# Altium schematic sheet B2_RAD_FPGA.SchDoc: ASIM MXGS PSU Controller QM
size A2; Author: Andrzej Cichocki; Organization: Space Research Centre; Address1: Bartycka 18a; Address2: 00-716 Warsaw; Address3: Poland; Revision: 1; ModuleName: MainBoard Main; SubOrganization1: FPGA Satellite Applications Lab.
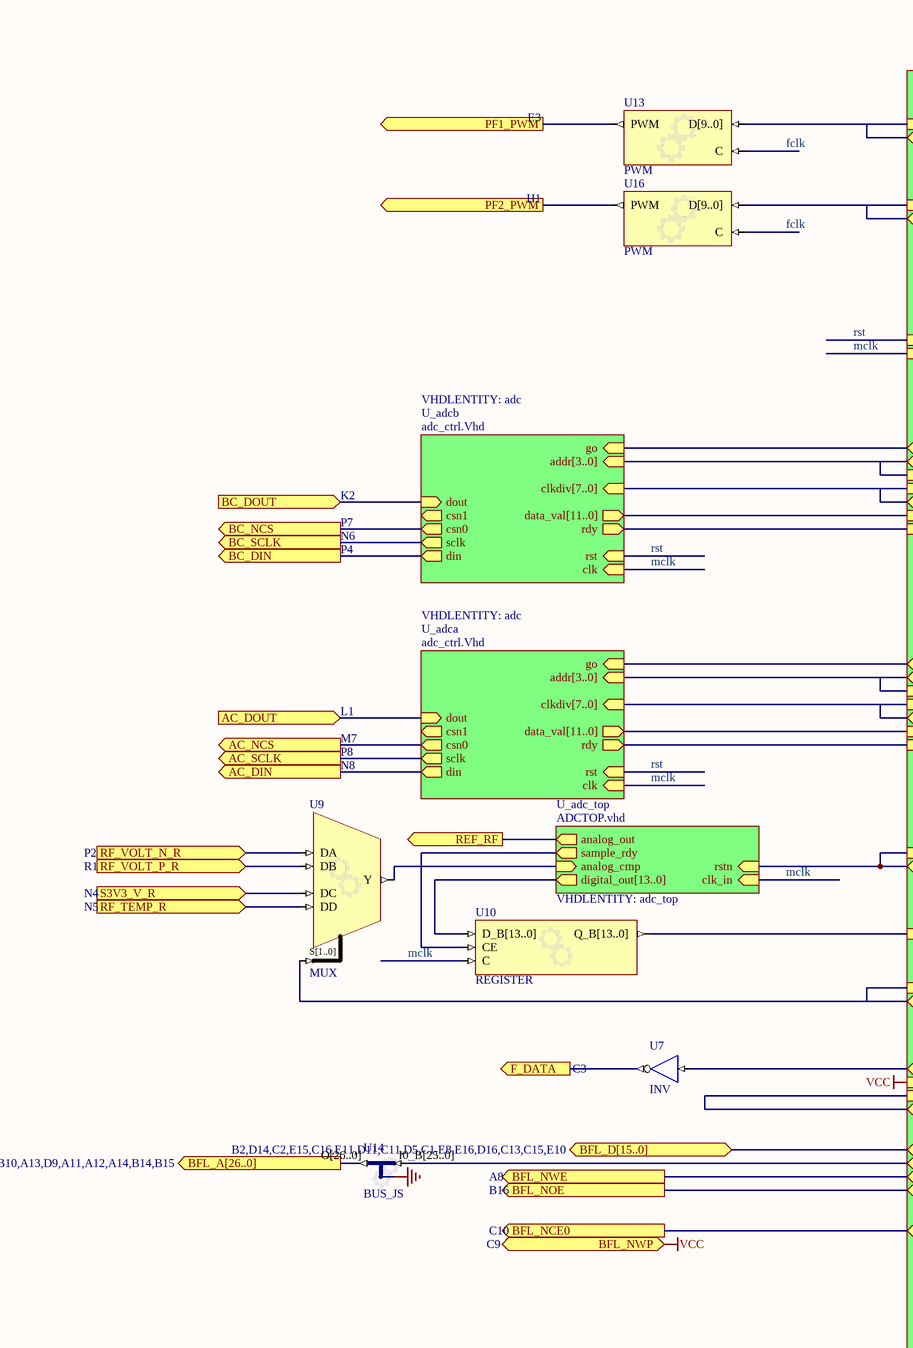
[diagram p0: B2_RAD_FPGA.SchDoc, left]
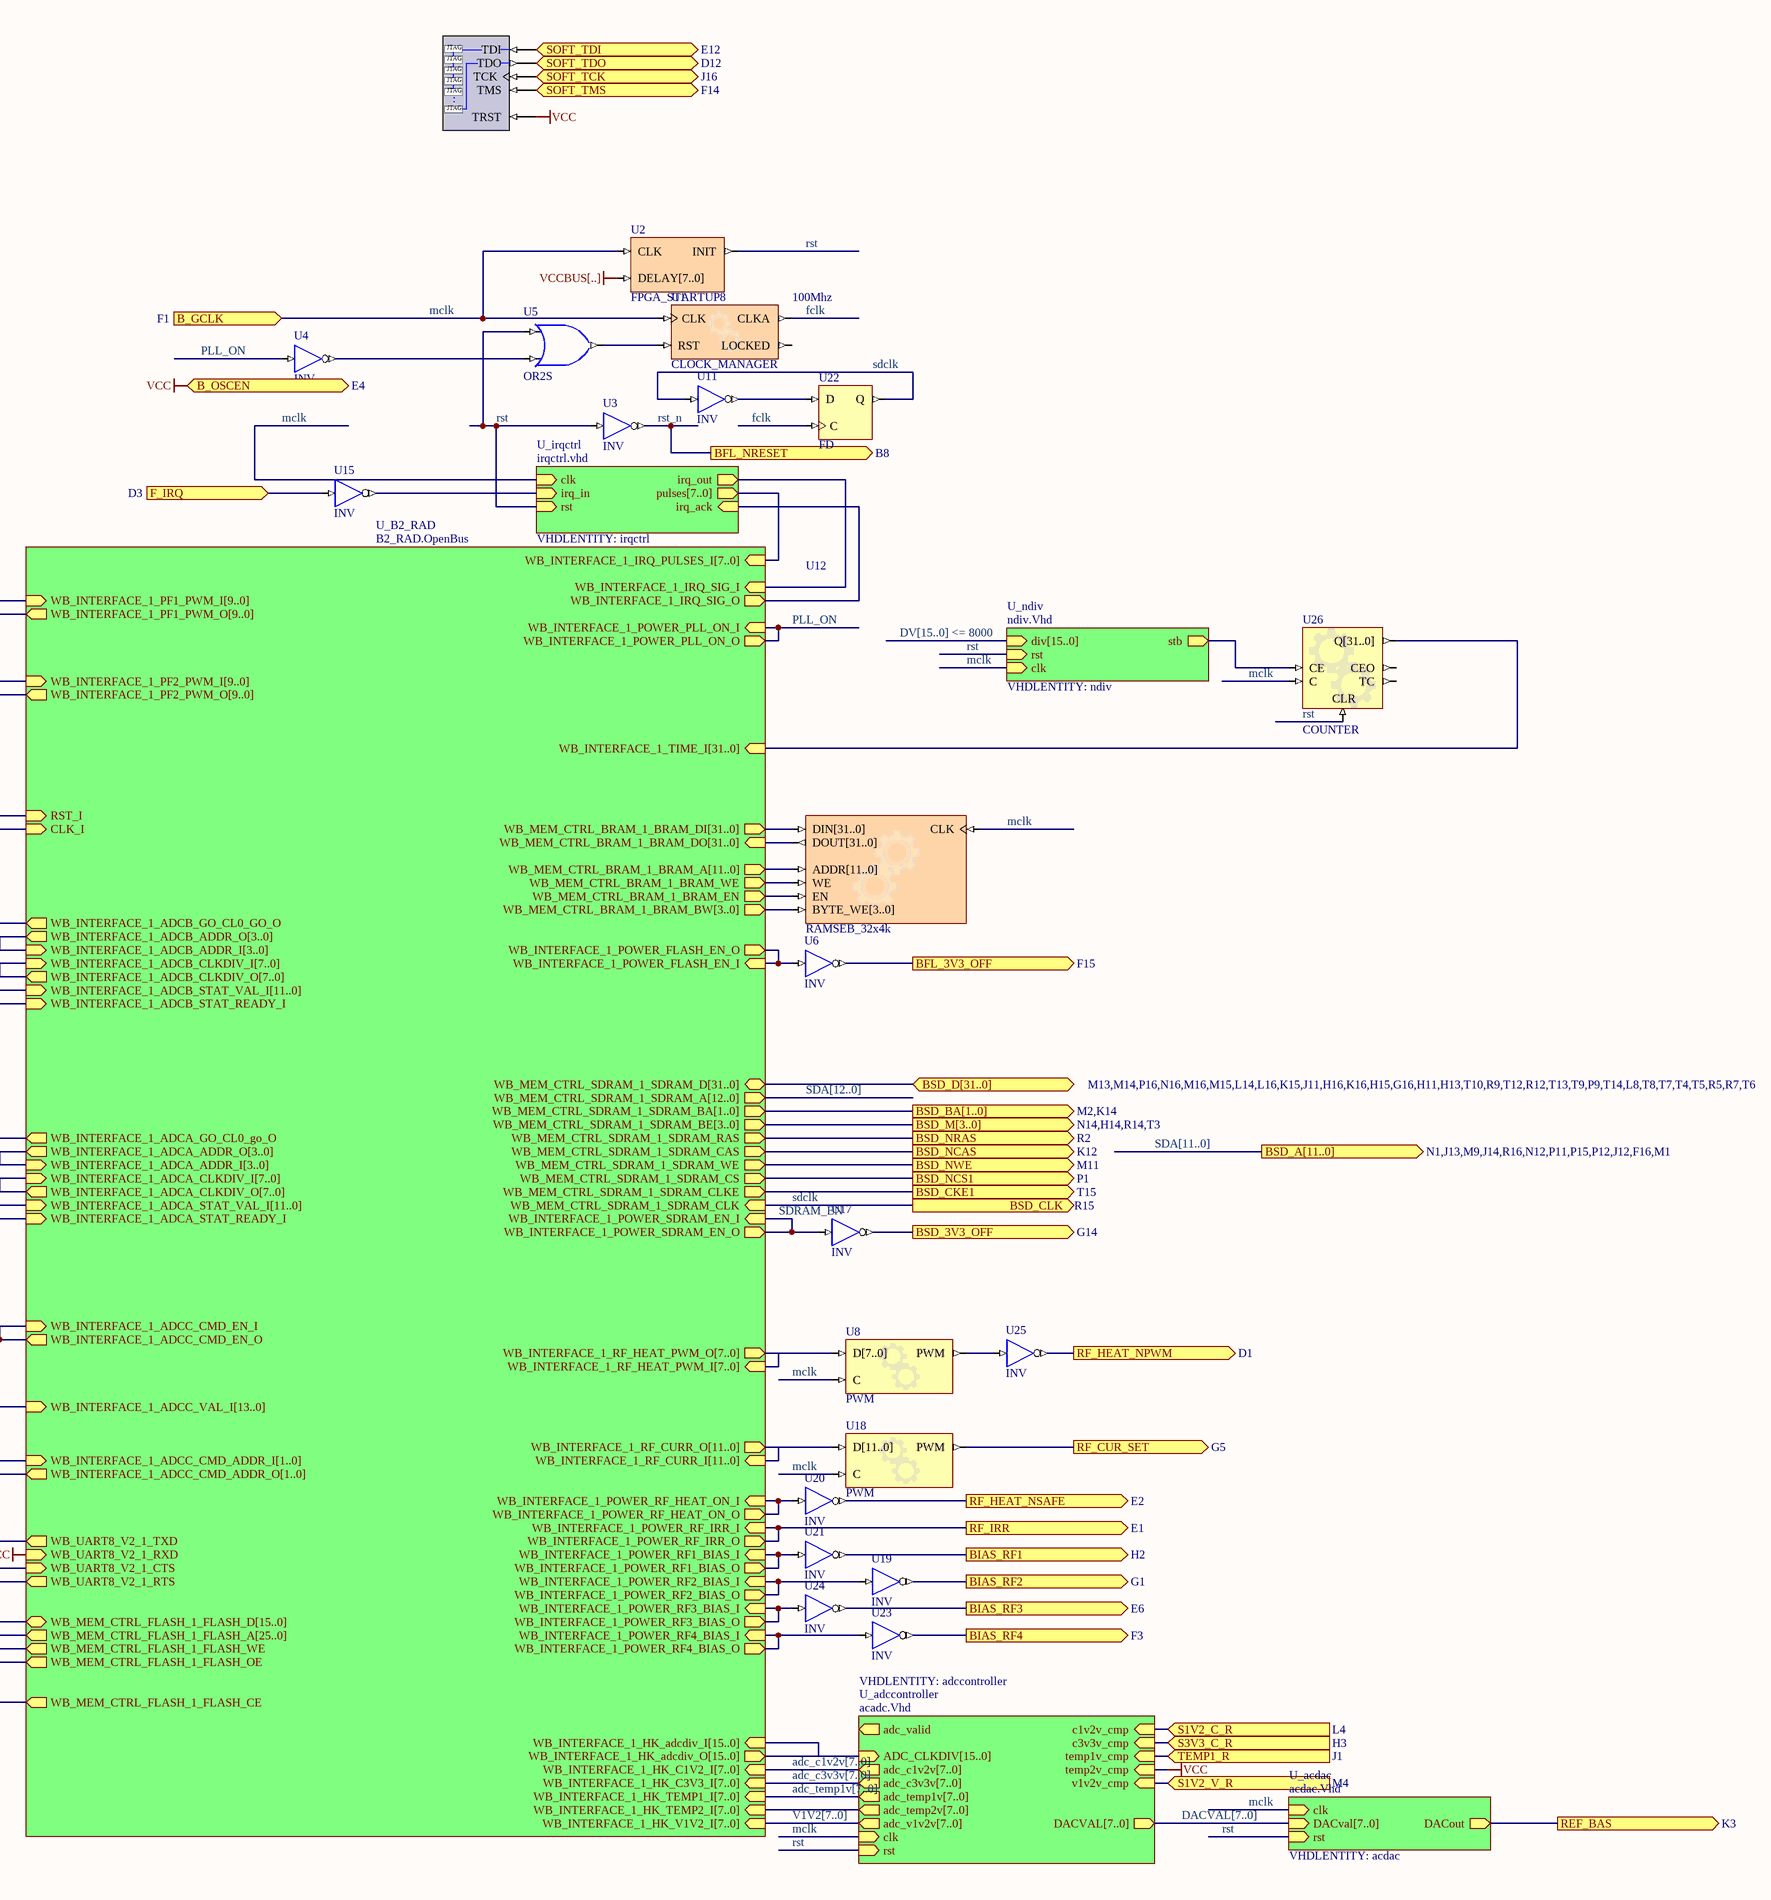
[diagram p1: B2_RAD_FPGA.SchDoc, right]

## Parts
NEXUS_JTAG_PORT  NEXUS_JTAG_PORT  (value not drawn)
U1  CLOCK_MANAGER
U2  FPGA_STARTUP8
U3  INV
U4  INV
U5  OR2S
U6  INV
U7  INV
U8  PWM
U9  MUX
U10  REGISTER
U11  INV
U12  RAMSEB_32x4k
U13  PWM
U14  BUS_JS
U15  INV
U16  PWM
U17  INV
U18  PWM
U19  INV
U20  INV
U21  INV
U22  FD
U23  INV
U24  INV
U25  INV
U26  COUNTER

## Sub-sheets
U_acdac = acdac.Vhd: clk (in), DACout (out), DACval[7..0] (in), rst (in)  | VHDLENTITY: acdac
U_adc_top = ADCTOP.vhd: analog_cmp (in), analog_out (out), clk_in (in), digital_out[13..0] (out), rstn (in), sample_rdy (out)  | VHDLENTITY: adc_top
U_adca = adc_ctrl.Vhd: clk (in), clkdiv[7..0] (in), data_val[11..0] (out), din (out), dout (in), go (in), rdy (out), rst (in), sclk (out), addr[3..0] (in), csn0 (out), csn1 (out)  | VHDLENTITY: adc
U_adcb = adc_ctrl.Vhd: clk (in), clkdiv[7..0] (in), data_val[11..0] (out), din (out), dout (in), go (in), rdy (out), rst (in), sclk (out), addr[3..0] (in), csn0 (out), csn1 (out)  | VHDLENTITY: adc
U_adccontroller = acadc.Vhd: ADC_CLKDIV[15..0] (in), adc_valid (out), clk (in), DACVAL[7..0] (out), rst (in), temp1v_cmp (in), c1v2v_cmp (in), temp2v_cmp (in), v1v2v_cmp (in), c3v3v_cmp (in), adc_temp1v[7..0] (out), adc_c1v2v[7..0] (out), adc_temp2v[7..0] (out), adc_v1v2v[7..0] (out), adc_c3v3v[7..0] (out)  | VHDLENTITY: adccontroller
U_B2_RAD = B2_RAD.OpenBus: RST_I (in), CLK_I (in), WB_UART8_V2_1_TXD (out), WB_UART8_V2_1_RXD (in), WB_UART8_V2_1_CTS (in), WB_UART8_V2_1_RTS (out), WB_MEM_CTRL_SDRAM_1_SDRAM_CLK (in), WB_MEM_CTRL_SDRAM_1_SDRAM_D[31..0] (bidir), WB_MEM_CTRL_SDRAM_1_SDRAM_BA[1..0] (out), WB_MEM_CTRL_SDRAM_1_SDRAM_BE[3..0] (out), WB_MEM_CTRL_SDRAM_1_SDRAM_RAS (out), WB_MEM_CTRL_SDRAM_1_SDRAM_CAS (out), WB_MEM_CTRL_SDRAM_1_SDRAM_WE (out), WB_MEM_CTRL_SDRAM_1_SDRAM_CS (out), WB_MEM_CTRL_SDRAM_1_SDRAM_CLKE (out), WB_MEM_CTRL_SDRAM_1_SDRAM_A[12..0] (out), WB_MEM_CTRL_BRAM_1_BRAM_DI[31..0] (out), WB_MEM_CTRL_BRAM_1_BRAM_DO[31..0] (in), WB_MEM_CTRL_BRAM_1_BRAM_WE (out), WB_MEM_CTRL_BRAM_1_BRAM_EN (out), WB_MEM_CTRL_BRAM_1_BRAM_BW[3..0] (out), WB_MEM_CTRL_BRAM_1_BRAM_A[11..0] (out), WB_INTERFACE_1_IRQ_PULSES_I[7..0] (in), WB_INTERFACE_1_HK_C1V2_I[7..0] (in), WB_INTERFACE_1_HK_C3V3_I[7..0] (in), WB_INTERFACE_1_HK_TEMP1_I[7..0] (in), WB_INTERFACE_1_HK_TEMP2_I[7..0] (in), WB_INTERFACE_1_HK_V1V2_I[7..0] (in), WB_INTERFACE_1_POWER_RF_IRR_I (in), WB_INTERFACE_1_POWER_RF_IRR_O (out), WB_INTERFACE_1_POWER_RF1_BIAS_I (in), WB_INTERFACE_1_POWER_RF1_BIAS_O (out), WB_INTERFACE_1_POWER_RF2_BIAS_I (in), WB_INTERFACE_1_POWER_RF2_BIAS_O (out), WB_INTERFACE_1_POWER_RF3_BIAS_I (in), WB_INTERFACE_1_POWER_RF3_BIAS_O (out), WB_INTERFACE_1_POWER_RF4_BIAS_I (in), WB_INTERFACE_1_POWER_RF4_BIAS_O (out), WB_INTERFACE_1_POWER_RF_HEAT_ON_I (in), WB_INTERFACE_1_POWER_RF_HEAT_ON_O (out), WB_INTERFACE_1_POWER_SDRAM_EN_I (in), WB_INTERFACE_1_POWER_SDRAM_EN_O (out), WB_INTERFACE_1_POWER_FLASH_EN_I (in), WB_INTERFACE_1_POWER_FLASH_EN_O (out), WB_INTERFACE_1_HK_adcdiv_I[15..0] (in), WB_INTERFACE_1_HK_adcdiv_O[15..0] (out), WB_MEM_CTRL_FLASH_1_FLASH_D[15..0] (bidir), WB_MEM_CTRL_FLASH_1_FLASH_A[25..0] (out), WB_MEM_CTRL_FLASH_1_FLASH_CE (out), WB_MEM_CTRL_FLASH_1_FLASH_WE (out), WB_MEM_CTRL_FLASH_1_FLASH_OE (out), WB_INTERFACE_1_RF_HEAT_PWM_I[7..0] (in), WB_INTERFACE_1_RF_HEAT_PWM_O[7..0] (out), WB_INTERFACE_1_POWER_PLL_ON_I (in), WB_INTERFACE_1_POWER_PLL_ON_O (out), WB_INTERFACE_1_RF_CURR_I[11..0] (in), WB_INTERFACE_1_RF_CURR_O[11..0] (out), WB_INTERFACE_1_PF1_PWM_I[9..0] (in), WB_INTERFACE_1_PF1_PWM_O[9..0] (out), WB_INTERFACE_1_PF2_PWM_I[9..0] (in), WB_INTERFACE_1_PF2_PWM_O[9..0] (out), WB_INTERFACE_1_ADCA_GO_CL0_go_O (out), WB_INTERFACE_1_ADCA_STAT_READY_I (in), WB_INTERFACE_1_ADCA_STAT_VAL_I[11..0] (in), WB_INTERFACE_1_ADCA_CLKDIV_I[7..0] (in), WB_INTERFACE_1_ADCA_CLKDIV_O[7..0] (out), WB_INTERFACE_1_ADCA_ADDR_I[3..0] (in), WB_INTERFACE_1_ADCA_ADDR_O[3..0] (out), WB_INTERFACE_1_ADCB_GO_CL0_GO_O (out), WB_INTERFACE_1_ADCB_STAT_READY_I (in), WB_INTERFACE_1_ADCB_STAT_VAL_I[11..0] (in), WB_INTERFACE_1_ADCB_CLKDIV_I[7..0] (in), WB_INTERFACE_1_ADCB_CLKDIV_O[7..0] (out), WB_INTERFACE_1_ADCB_ADDR_I[3..0] (in), WB_INTERFACE_1_ADCB_ADDR_O[3..0] (out), WB_INTERFACE_1_ADCC_CMD_EN_I (in), WB_INTERFACE_1_ADCC_CMD_EN_O (out), WB_INTERFACE_1_ADCC_CMD_ADDR_I[1..0] (in), WB_INTERFACE_1_ADCC_CMD_ADDR_O[1..0] (out), WB_INTERFACE_1_ADCC_VAL_I[13..0] (in), WB_INTERFACE_1_TIME_I[31..0] (in), WB_INTERFACE_1_IRQ_SIG_I (in), WB_INTERFACE_1_IRQ_SIG_O (out)
U_irqctrl = irqctrl.vhd: clk (in), irq_in (in), irq_out (out), pulses[7..0] (out), rst (in), irq_ack (in)  | VHDLENTITY: irqctrl
U_ndiv = ndiv.Vhd: clk (in), div[15..0] (in), rst (in), stb (out)  | VHDLENTITY: ndiv

## Ports
AC_DIN (out, see N8), AC_DOUT (in, see L1), AC_NCS (out, see M7), AC_SCLK (out, see P8), B_GCLK (in, see F1), B_OSCEN (out, see E4), BC_DIN (out, see P4), BC_DOUT (in, see K2), BC_NCS (out, see P7), BC_SCLK (out, see N6), BFL_3V3_OFF (out, see F15), BFL_A[26..0] (out, see B12,B1,A2,A3,B5,C7,E7,C8,F6,A10,C5,B3,A4,B6,A5,D6,C6,A7,A6,B10,A13,D9,A11,A12,A14,B14,B15), BFL_D[15..0] (bidir, see B2,D14,C2,E15,C16,E11,D11,C11,D5,C1,E8,E16,D16,C13,C15,E10), BFL_NCE0 (out, see C10), BFL_NOE (out, see B16), BFL_NRESET (out, see B8), BFL_NWE (out, see A8), BFL_NWP (out, see C9), BIAS_RF1 (out, see H2), BIAS_RF2 (out, see G1), BIAS_RF3 (out, see E6), BIAS_RF4 (out, see F3), BSD_3V3_OFF (out, see G14), BSD_A[11..0] (out, see N1,J13,M9,J14,R16,N12,P11,P15,P12,J12,F16,M1), BSD_BA[1..0] (out, see M2,K14), BSD_CKE1 (out, see T15), BSD_CLK (out, see R15), BSD_D[31..0] (bidir, see M13,M14,P16,N16,M16,M15,L14,L16,K15,J11,H16,K16,H15,G16,H11,H13,T10,R9,T12,R12,T13,T9,P9,T14,L8,T8,T7,T4,T5,R5,R7,T6), BSD_M[3..0] (out, see N14,H14,R14,T3), BSD_NCAS (out, see K12), BSD_NCS1 (out, see P1), BSD_NRAS (out, see R2), BSD_NWE (out, see M11), F_DATA (out, see C3), F_IRQ (in, see D3), PF1_PWM (out, see E3), PF2_PWM (out, see H1), REF_BAS (out, see K3), REF_RF (out, see K1), RF_CUR_SET (out, see G5), RF_HEAT_NPWM (out, see D1), RF_HEAT_NSAFE (out, see E2), RF_IRR (out, see E1), RF_TEMP_R (in, see N5), RF_VOLT_N_R (in, see P2), RF_VOLT_P_R (in, see R1), S1V2_C_R (in, see L4), S1V2_V_R (in, see M4), S3V3_C_R (in, see H3), S3V3_V_R (in, see N4), SOFT_TCK (in, see J16), SOFT_TDI (in, see E12), SOFT_TDO (out, see D12), SOFT_TMS (in, see F14), TEMP1_R (in, see J1)

## Nets
GND: U14.I1
VCC: NEXUS_JTAG_PORT.TRST ; port BFL_NWP, port B_OSCEN, sheet U_B2_RAD/WB_UART8_V2_1_RXD, sheet U_adccontroller/temp2v_cmp
VCCBUS[..]: U2.DELAY[7..0]
AC_DIN: port AC_DIN, sheet U_adca/din
AC_DOUT: port AC_DOUT, sheet U_adca/dout
AC_NCS: port AC_NCS, sheet U_adca/csn0
AC_SCLK: port AC_SCLK, sheet U_adca/sclk
BC_DIN: port BC_DIN, sheet U_adcb/din
BC_DOUT: port BC_DOUT, sheet U_adcb/dout
BC_NCS: port BC_NCS, sheet U_adcb/csn0
BC_SCLK: port BC_SCLK, sheet U_adcb/sclk
BFL_3V3_OFF: U6.O ; port BFL_3V3_OFF
BFL_A[26..0]: U14.O[26..0] ; port BFL_A[26..0]
BFL_NCE0: port BFL_NCE0, sheet U_B2_RAD/WB_MEM_CTRL_FLASH_1_FLASH_CE
BFL_NOE: port BFL_NOE, sheet U_B2_RAD/WB_MEM_CTRL_FLASH_1_FLASH_OE
BFL_NWE: port BFL_NWE, sheet U_B2_RAD/WB_MEM_CTRL_FLASH_1_FLASH_WE
BIAS_RF1: U21.O ; port BIAS_RF1
BIAS_RF2: U19.O ; port BIAS_RF2
BIAS_RF3: U24.O ; port BIAS_RF3
BIAS_RF4: U23.O ; port BIAS_RF4
BSD_3V3_OFF: U17.O ; port BSD_3V3_OFF
BSD_CKE1: port BSD_CKE1, sheet U_B2_RAD/WB_MEM_CTRL_SDRAM_1_SDRAM_CLKE
BSD_NCAS: port BSD_NCAS, sheet U_B2_RAD/WB_MEM_CTRL_SDRAM_1_SDRAM_CAS
BSD_NCS1: port BSD_NCS1, sheet U_B2_RAD/WB_MEM_CTRL_SDRAM_1_SDRAM_CS
BSD_NRAS: port BSD_NRAS, sheet U_B2_RAD/WB_MEM_CTRL_SDRAM_1_SDRAM_RAS
BSD_NWE: port BSD_NWE, sheet U_B2_RAD/WB_MEM_CTRL_SDRAM_1_SDRAM_WE
F_DATA: U7.O ; port F_DATA
F_IRQ: U15.I ; port F_IRQ
fclk: U1.CLKA U13.C U16.C U22.C
mclk: U1.CLK U2.CLK U8.C U10.C U12.CLK U18.C U26.C ; port B_GCLK, sheet U_B2_RAD/CLK_I, sheet U_irqctrl/clk, sheet U_adccontroller/clk, sheet U_acdac/clk, sheet U_adcb/clk, sheet U_adca/clk, sheet U_adc_top/clk_in, sheet U_ndiv/clk
PF1_PWM: U13.PWM ; port PF1_PWM
PF2_PWM: U16.PWM ; port PF2_PWM
PLL_ON: U4.I ; sheet U_B2_RAD/WB_INTERFACE_1_POWER_PLL_ON_I, sheet U_B2_RAD/WB_INTERFACE_1_POWER_PLL_ON_O
REF_BAS: port REF_BAS, sheet U_acdac/DACout
REF_RF: port REF_RF, sheet U_adc_top/analog_out
RF_CUR_SET: U18.PWM ; port RF_CUR_SET
RF_HEAT_NPWM: U25.O ; port RF_HEAT_NPWM
RF_HEAT_NSAFE: U20.O ; port RF_HEAT_NSAFE
RF_IRR: port RF_IRR, sheet U_B2_RAD/WB_INTERFACE_1_POWER_RF_IRR_I, sheet U_B2_RAD/WB_INTERFACE_1_POWER_RF_IRR_O
RF_TEMP_R: U9.DD ; port RF_TEMP_R
RF_VOLT_N_R: U9.DA ; port RF_VOLT_N_R
RF_VOLT_P_R: U9.DB ; port RF_VOLT_P_R
rst: U2.INIT U3.I U5.I0 U26.CLR ; sheet U_B2_RAD/RST_I, sheet U_irqctrl/rst, sheet U_adccontroller/rst, sheet U_acdac/rst, sheet U_adcb/rst, sheet U_adca/rst, sheet U_ndiv/rst
rst_n: U3.O ; port BFL_NRESET
S1V2_C_R: port S1V2_C_R, sheet U_adccontroller/c1v2v_cmp
S1V2_V_R: port S1V2_V_R, sheet U_adccontroller/v1v2v_cmp
S3V3_C_R: port S3V3_C_R, sheet U_adccontroller/c3v3v_cmp
S3V3_V_R: U9.DC ; port S3V3_V_R
sdclk: U11.I U22.Q ; port BSD_CLK, sheet U_B2_RAD/WB_MEM_CTRL_SDRAM_1_SDRAM_CLK
SDRAM_EN: U17.I ; sheet U_B2_RAD/WB_INTERFACE_1_POWER_SDRAM_EN_I, sheet U_B2_RAD/WB_INTERFACE_1_POWER_SDRAM_EN_O
SOFT_TCK: NEXUS_JTAG_PORT.TCK ; port SOFT_TCK
SOFT_TDI: NEXUS_JTAG_PORT.TDI ; port SOFT_TDI
SOFT_TDO: NEXUS_JTAG_PORT.TDO ; port SOFT_TDO
SOFT_TMS: NEXUS_JTAG_PORT.TMS ; port SOFT_TMS
TEMP1_R: port TEMP1_R, sheet U_adccontroller/temp1v_cmp
NetU1_RST: U1.RST U5.O
NetU4_O: U4.O U5.I1
NetU6_I: U6.I ; sheet U_B2_RAD/WB_INTERFACE_1_POWER_FLASH_EN_I, sheet U_B2_RAD/WB_INTERFACE_1_POWER_FLASH_EN_O
NetU7_I: U7.I ; sheet U_B2_RAD/WB_UART8_V2_1_TXD
NetU8_D[7..0]: U8.D[7..0] ; sheet U_B2_RAD/WB_INTERFACE_1_RF_HEAT_PWM_I[7..0], sheet U_B2_RAD/WB_INTERFACE_1_RF_HEAT_PWM_O[7..0]
NetU8_PWM: U8.PWM U25.I
NetU9_S[1..0]: U9.S[1..0] ; sheet U_B2_RAD/WB_INTERFACE_1_ADCC_CMD_ADDR_I[1..0], sheet U_B2_RAD/WB_INTERFACE_1_ADCC_CMD_ADDR_O[1..0]
NetU9_Y: U9.Y ; sheet U_adc_top/analog_cmp
NetU10_CE: U10.CE ; sheet U_adc_top/sample_rdy
NetU10_D_B[13..0]: U10.D_B[13..0] ; sheet U_adc_top/digital_out[13..0]
NetU10_Q_B[13..0]: U10.Q_B[13..0] ; sheet U_B2_RAD/WB_INTERFACE_1_ADCC_VAL_I[13..0]
NetU11_O: U11.O U22.D
NetU12_ADDR[11..0]: U12.ADDR[11..0] ; sheet U_B2_RAD/WB_MEM_CTRL_BRAM_1_BRAM_A[11..0]
NetU12_BYTE_WE[3..0]: U12.BYTE_WE[3..0] ; sheet U_B2_RAD/WB_MEM_CTRL_BRAM_1_BRAM_BW[3..0]
NetU12_DIN[31..0]: U12.DIN[31..0] ; sheet U_B2_RAD/WB_MEM_CTRL_BRAM_1_BRAM_DI[31..0]
NetU12_DOUT[31..0]: U12.DOUT[31..0] ; sheet U_B2_RAD/WB_MEM_CTRL_BRAM_1_BRAM_DO[31..0]
NetU12_EN: U12.EN ; sheet U_B2_RAD/WB_MEM_CTRL_BRAM_1_BRAM_EN
NetU12_WE: U12.WE ; sheet U_B2_RAD/WB_MEM_CTRL_BRAM_1_BRAM_WE
NetU13_D[9..0]: U13.D[9..0] ; sheet U_B2_RAD/WB_INTERFACE_1_PF1_PWM_I[9..0], sheet U_B2_RAD/WB_INTERFACE_1_PF1_PWM_O[9..0]
NetU14_I0_B[25..0]: U14.I0_B[25..0] ; sheet U_B2_RAD/WB_MEM_CTRL_FLASH_1_FLASH_A[25..0]
NetU15_O: U15.O ; sheet U_irqctrl/irq_in
NetU16_D[9..0]: U16.D[9..0] ; sheet U_B2_RAD/WB_INTERFACE_1_PF2_PWM_I[9..0], sheet U_B2_RAD/WB_INTERFACE_1_PF2_PWM_O[9..0]
NetU18_D[11..0]: U18.D[11..0] ; sheet U_B2_RAD/WB_INTERFACE_1_RF_CURR_I[11..0], sheet U_B2_RAD/WB_INTERFACE_1_RF_CURR_O[11..0]
NetU19_I: U19.I ; sheet U_B2_RAD/WB_INTERFACE_1_POWER_RF2_BIAS_I, sheet U_B2_RAD/WB_INTERFACE_1_POWER_RF2_BIAS_O
NetU20_I: U20.I ; sheet U_B2_RAD/WB_INTERFACE_1_POWER_RF_HEAT_ON_I, sheet U_B2_RAD/WB_INTERFACE_1_POWER_RF_HEAT_ON_O
NetU21_I: U21.I ; sheet U_B2_RAD/WB_INTERFACE_1_POWER_RF1_BIAS_I, sheet U_B2_RAD/WB_INTERFACE_1_POWER_RF1_BIAS_O
NetU23_I: U23.I ; sheet U_B2_RAD/WB_INTERFACE_1_POWER_RF4_BIAS_I, sheet U_B2_RAD/WB_INTERFACE_1_POWER_RF4_BIAS_O
NetU24_I: U24.I ; sheet U_B2_RAD/WB_INTERFACE_1_POWER_RF3_BIAS_I, sheet U_B2_RAD/WB_INTERFACE_1_POWER_RF3_BIAS_O
NetU26_CE: U26.CE ; sheet U_ndiv/stb
NetU26_Q[31..0]: U26.Q[31..0] ; sheet U_B2_RAD/WB_INTERFACE_1_TIME_I[31..0]
(unnamed): sheet U_B2_RAD/WB_UART8_V2_1_CTS, sheet U_B2_RAD/WB_UART8_V2_1_RTS
(unnamed): sheet U_B2_RAD/WB_INTERFACE_1_ADCA_GO_CL0_go_O, sheet U_adca/go
(unnamed): sheet U_B2_RAD/WB_INTERFACE_1_ADCA_STAT_READY_I, sheet U_adca/rdy
(unnamed): sheet U_B2_RAD/WB_INTERFACE_1_ADCB_GO_CL0_GO_O, sheet U_adcb/go
(unnamed): sheet U_B2_RAD/WB_INTERFACE_1_ADCB_STAT_READY_I, sheet U_adcb/rdy
(unnamed): sheet U_B2_RAD/WB_INTERFACE_1_ADCC_CMD_EN_I, sheet U_B2_RAD/WB_INTERFACE_1_ADCC_CMD_EN_O, sheet U_adc_top/rstn
(unnamed): sheet U_B2_RAD/WB_INTERFACE_1_IRQ_SIG_I, sheet U_irqctrl/irq_out
(unnamed): sheet U_B2_RAD/WB_INTERFACE_1_IRQ_SIG_O, sheet U_irqctrl/irq_ack

Not connected (* = marked no-connect by the designer): U1 LOCKED; U26 CEO TC

## Buses and harness runs
bus adc_c1v2v[7..0] = sheet U_adccontroller/adc_c1v2v[7..0] = sheet U_B2_RAD/WB_INTERFACE_1_HK_C1V2_I[7..0]
bus adc_c3v3v[7..0] = sheet U_adccontroller/adc_c3v3v[7..0] = sheet U_B2_RAD/WB_INTERFACE_1_HK_C3V3_I[7..0]
bus adc_temp1v[7..0] = sheet U_adccontroller/adc_temp1v[7..0] = sheet U_B2_RAD/WB_INTERFACE_1_HK_TEMP1_I[7..0]
bus DACVAL[7..0] = sheet U_acdac/DACval[7..0] = sheet U_adccontroller/DACVAL[7..0]
bus DV[15..0] <= 8000 = sheet U_ndiv/div[15..0]
bus port BFL_D[15..0] = sheet U_B2_RAD/WB_MEM_CTRL_FLASH_1_FLASH_D[15..0]
bus port BSD_BA[1..0] = sheet U_B2_RAD/WB_MEM_CTRL_SDRAM_1_SDRAM_BA[1..0]
bus port BSD_D[31..0] = sheet U_B2_RAD/WB_MEM_CTRL_SDRAM_1_SDRAM_D[31..0]
bus port BSD_M[3..0] = sheet U_B2_RAD/WB_MEM_CTRL_SDRAM_1_SDRAM_BE[3..0]
bus SDA[11..0] = port BSD_A[11..0]
bus SDA[12..0] = sheet U_B2_RAD/WB_MEM_CTRL_SDRAM_1_SDRAM_A[12..0]
bus sheet U_adca/addr[3..0] = sheet U_B2_RAD/WB_INTERFACE_1_ADCA_ADDR_I[3..0] = sheet U_B2_RAD/WB_INTERFACE_1_ADCA_ADDR_O[3..0]
bus sheet U_adca/clkdiv[7..0] = sheet U_B2_RAD/WB_INTERFACE_1_ADCA_CLKDIV_I[7..0] = sheet U_B2_RAD/WB_INTERFACE_1_ADCA_CLKDIV_O[7..0]
bus sheet U_adca/data_val[11..0] = sheet U_B2_RAD/WB_INTERFACE_1_ADCA_STAT_VAL_I[11..0]
bus sheet U_adcb/addr[3..0] = sheet U_B2_RAD/WB_INTERFACE_1_ADCB_ADDR_I[3..0] = sheet U_B2_RAD/WB_INTERFACE_1_ADCB_ADDR_O[3..0]
bus sheet U_adcb/clkdiv[7..0] = sheet U_B2_RAD/WB_INTERFACE_1_ADCB_CLKDIV_I[7..0] = sheet U_B2_RAD/WB_INTERFACE_1_ADCB_CLKDIV_O[7..0]
bus sheet U_adcb/data_val[11..0] = sheet U_B2_RAD/WB_INTERFACE_1_ADCB_STAT_VAL_I[11..0]
bus sheet U_adccontroller/ADC_CLKDIV[15..0] = sheet U_B2_RAD/WB_INTERFACE_1_HK_adcdiv_I[15..0] = sheet U_B2_RAD/WB_INTERFACE_1_HK_adcdiv_O[15..0]
bus sheet U_adccontroller/adc_temp2v[7..0] = sheet U_B2_RAD/WB_INTERFACE_1_HK_TEMP2_I[7..0]
bus sheet U_B2_RAD/WB_INTERFACE_1_ADCC_CMD_ADDR_I[1..0] = sheet U_B2_RAD/WB_INTERFACE_1_ADCC_CMD_ADDR_O[1..0]
bus sheet U_B2_RAD/WB_INTERFACE_1_IRQ_PULSES_I[7..0] = sheet U_irqctrl/pulses[7..0]
bus sheet U_B2_RAD/WB_INTERFACE_1_PF1_PWM_I[9..0] = sheet U_B2_RAD/WB_INTERFACE_1_PF1_PWM_O[9..0]
bus sheet U_B2_RAD/WB_INTERFACE_1_PF2_PWM_I[9..0] = sheet U_B2_RAD/WB_INTERFACE_1_PF2_PWM_O[9..0]
bus sheet U_B2_RAD/WB_INTERFACE_1_RF_CURR_I[11..0] = sheet U_B2_RAD/WB_INTERFACE_1_RF_CURR_O[11..0]
bus sheet U_B2_RAD/WB_INTERFACE_1_RF_HEAT_PWM_I[7..0] = sheet U_B2_RAD/WB_INTERFACE_1_RF_HEAT_PWM_O[7..0]
bus V1V2[7..0] = sheet U_adccontroller/adc_v1v2v[7..0] = sheet U_B2_RAD/WB_INTERFACE_1_HK_V1V2_I[7..0]

## Notes on the sheet
- (near U1) 100Mhz
- Module:
- Project:
- Modified:
- Rev.:
- Author:
- (in symbol NEXUS_JTAG_PORT) .

## Library data of the parts
NEXUS_JTAG_PORT = NEXUS_JTAG_PORT: Soft Nexus-Chain Connector; NEXUS_JTAG_CONNECTOR: True; FunctionalClass: JTAG; Published: 29-Jan-2004; Publisher: Altium Limited; LastRevisionNo: 1.00.00; HelpURL: CR0118 FPGA Generic Library Guide.pdf#page=405
U1 = CLOCKMANAGER: Configurable Clock Manager; ConfiguratorName: GENERIC_CLOCKMANAGER; ConfigurationParameters: {}Version[1.0]{}Option_Configuration[object _1: TClockManagerPersist / VersionMajor [ 0 / VersionMinor [ 0 / InputFreq [ 8.000000000000000000 / InputName [ 'CLK' / OutputTargets [ < / item / Name [ 'CLKA' / OutFreqMin [ 100.000000000000000000 / OutFreqMax [ 100.000000000000000000 / OutPostDivider [ 1.000000000000000000 / end> / OutputDevices [ < / item / Name [ 'Spartan6' / Valid [ True / OutputActuals [ < / item / Name [ 'CLK0' / Multipler [ 1.000000000000000000 / Divider [ 1.000000000000000000 / OutFreq [ 8.000000000000000000 / OutputMap [ 1 / end / item / Name [ 'CLK90' / Multipler [ 1.000000000000000000 / Divider [ 1.000000000000000000 / OutPhase [ 90.000000000000000000 / OutFreq [ 8.000000000000000000 / OutputMap [ 2 / end / item / Name [ 'CLK180' / Multipler [ 1.000000000000000000 / Divider [ 1.000000000000000000 / OutPhase [ 180.000000000000000000 / OutFreq [ 8.000000000000000000 / OutputMap [ 3 / end / item / Name [ 'CLK270' / Multipler [ 1.000000000000000000 / Divider [ 1.000000000000000000 / OutPhase [ 270.000000000000000000 / OutFreq [ 8.000000000000000000 / OutputMap [ 4 / end / item / Name [ 'CLK2X' / Multipler [ 2.000000000000000000 / Divider [ 1.000000000000000000 / OutFreq [ 16.000000000000000000 / OutputMap [ 5 / end / item / Name [ 'CLKDV' / Multipler [ 1.000000000000000000 / Divider [ 16.000000000000000000 / OutFreq [ 0.500000000000000000 / OutputMap [ 6 / end / item / Name [ 'CLK2X180' / Multipler [ 1.000000000000000000 / Divider [ 1.000000000000000000 / OutPhase [ 180.000000000000000000 / OutFreq [ 16.000000000000000000 / OutputMap [ 7 / end / item / Name [ 'CLKFX' / Multipler [ 25.000000000000000000 / Divider [ 2.000000000000000000 / OutFreq [ 100.000000000000000000 / OutputMap [ 0 / end / item / Name [ 'CLKFX180' / Multipler [ 1.000000000000000000 / Divider [ 1.000000000000000000 / OutPhase [ 180.000000000000000000 / OutFreq [ 100.000000000000000000 / OutputMap [ 8 / end> / InternalActuals [ <> / CustomVars [ <> / end> / MinInputFreq [ 5.000000000000000000 / MaxInputFreq [ 280.000000000000000000 / MinOutputFreq [ 5.000000000000000000 / MaxOutputFreq [ 375.000000000000000000 / MaxOutputCount [ 9 / end]{}; LastRevisionNo: 1.00.00; Published: 18-Feb-2009; Publisher: Altium Limited; HelpURL: https://wiki.altium.com/display/ADOH/New+Configurable+Generic+FPGA+Logic+Components
U2 = FPGA_STARTUP8: FPGA Startup With 8 Bit Delay; Published: 9-Dec-2004; Publisher: Altium Limited; HelpURL: CR0119 FPGA_STARTUPx Powerup Delay Unit.pdf; LastRevisionNo: 1.00.00; ComponentLink1Description: Core &Resource Usage; ComponentLink1URL: CR0139 FPGA Peripheral Resource Usage.pdf#page=11
U3 U4 U6 U7 U11 U15 U17 U19-U21 U23-U25 = INV: Inverter; FunctionalClass: Logic Primitive; ArchiveName: GENERIC; VHDLIB_SIM: GENERIC_LIB; Published: 29-Jan-2004; Publisher: Altium Limited; XilinxEquivalent: INV; LastRevisionNo: 1.00.00; HelpURL: CR0118 FPGA Generic Library Guide.pdf#page=291; ComponentLink1URL: CR0136 FPGA Logic Primitive Resource Usage.pdf#page=61; ComponentLink1Description: Core &Resource Usage; SubClass: INV
U5 = OR2S: 2-Input OR Gate, Single Pin Version; XilinxEquivalent: OR2; FunctionalClass: Logic Primitive; PortSize: 2; ArchiveName: GENERIC; VHDLIB_SIM: GENERIC_LIB; Published: 29-Jan-2004; Publisher: Altium Limited; LastRevisionNo: 1.00.00; HelpURL: CR0118 FPGA Generic Library Guide.pdf#page=410; ComponentLink1URL: CR0136 FPGA Logic Primitive Resource Usage.pdf#page=190; ComponentLink1Description: Core &Resource Usage; SubClass: OR; PortStyle: Single Pin Version
U8 = PWM: Configurable PWM; ConfiguratorName: GENERIC_PWM; ConfigurationParameters: {}Version[1.0]{}Width[8]{}Prescaler[100]{}; LastRevisionNo: 1.00.00; Published: 8-Apr-2009; Publisher: Altium Limited; HelpURL: https://wiki.altium.com/display/ADOH/New+Configurable+Generic+FPGA+Logic+Components
U9 = MUX: Configurable Mutliplexer; ConfigurationParameters: {}Version[1.0]{}ShowEnable[False]{}BusInputs[False]{}BusOutputs[False]{}SignalWidth[1]{}Type[Multiplexer]{}RegisterOutputs[False]{}NegativeClockEdge[False]{}ShowPinNames[True]{}InvertSingleSignal[False]{}SignalCount[4]{}Invert0[False]{}Invert1[False]{}Invert2[False]{}Invert3[False]{}; ConfiguratorName: GENERIC_MULTIPLEXER; LastRevisionNo: 1.00.00; Published: 31-Dec-2008; Publisher: Altium Limited
U10 = REGISTER: Configurable Register; ConfiguratorName: GENERIC_REGISTER; ConfigurationParameters: {}Version[1.1]{}RegisterType[DFlipFlop]{}NegativeTrigger[False]{}TriggerEnable[True]{}ResetMode[None]{}SetMode[None]{}SignalCount[1]{}SignalWidth0[14]{}OutputOption0[Normal]{}; LastRevisionNo: 1.00.00; Published: 13-Oct-2008; Publisher: Altium Limited; HelpURL: https://wiki.altium.com/display/ADOH/Configurable+Generic+Library
U12 = MEMORY: Configurable Memory; ConfiguratorName: GENERIC_MEMORY; ConfigurationParameters: {}Version[1.0]{}Option_MemoryDepthText[4k]{}Option_MemoryWidth[32]{}Option_PortCount[0]{}Option_MemoryType[0]{}Option_ByteWrites[True]{}Option_RisingEdgeClock[True]{}Option_EnablePin[True]{}Option_ResetPin[False]{}Option_UseDistributed[False]{}Option_InitMemoryFlag[False]{}Option_MemoryFileName[ ]{}Option_MemoryFileEndiannessBig[True]{}Option_MemoryFileEndiannessLittle[False]{}; LastRevisionNo: 1.00.00; Published: 28-Oct-2008; Publisher: Altium Limited; HelpURL: https://wiki.altium.com/display/ADOH/Configurable+Generic+Library
U13 U16 = PWM: Configurable PWM; ConfiguratorName: GENERIC_PWM; ConfigurationParameters: {}Version[1.0]{}Width[10]{}Prescaler[1]{}; LastRevisionNo: 1.00.00; Published: 8-Apr-2009; Publisher: Altium Limited; HelpURL: https://wiki.altium.com/display/ADOH/New+Configurable+Generic+FPGA+Logic+Components
U14 = BUS_JS: Configurable Bus Joiner/Splitter; ConfiguratorName: GENERIC_BUS_JS; ConfigurationParameters: {}Version[1.1]{}SplitterJoinerType[Joiner]{}SignalCount[2]{}SignalWidth0[26]{}GapBelow0[1000000]{}ConnectionType0[Pin]{}SignalWidth1[1]{}GapBelow1[1000000]{}ConnectionType1[GND]{}ShowPinNames[True]{}; LastRevisionNo: 1.00.00; Published: 17-Sep-2008; Publisher: Altium Limited; HelpURL: https://wiki.altium.com/display/ADOH/Configurable+Generic+Library
U18 = PWM: Configurable PWM; ConfiguratorName: GENERIC_PWM; ConfigurationParameters: {}Version[1.0]{}Width[12]{}Prescaler[1]{}; LastRevisionNo: 1.00.00; Published: 8-Apr-2009; Publisher: Altium Limited; HelpURL: https://wiki.altium.com/display/ADOH/New+Configurable+Generic+FPGA+Logic+Components
U22 = FD: D-Type Flip-Flop; ClockTrigger: Rising; ArchiveName: GENERIC; VHDLIB_SIM: GENERIC_LIB; Published: 29-Jan-2004; Publisher: Altium Limited; XilinxEquivalent: FD; LastRevisionNo: 1.00.00; HelpURL: CR0118 FPGA Generic Library Guide.pdf#page=170; ComponentLink1URL: CR0133 FPGA Flip Flop Resource Usage.pdf#page=4; ComponentLink1Description: Core &Resource Usage; FunctionalClass: Flip-Flop; SubClass: FD
U26 = COUNTER: Configurable Counter; ConfiguratorName: GENERIC_COUNTER; ConfigurationParameters: {}Version[1.0]{}Type[Binary]{}SyncReset[False]{}NegativeClockEdge[False]{}FixedDirection[True]{}IsIncrement[True]{}SignalWidth[32]{}MaxValue[4294967295]{}BusOutput[True]{}Loadable[False]{}BusInput[False]{}; LastRevisionNo: 1.00.00; Published: 14-Jan-2009; Publisher: Altium Limited